# Altium schematic sheet hv_control.SchDoc: AcroIQ HV LED: MCU
size A4; DocumentNumber: 4; Revision: B; SheetNumber: 3; SheetTotal: 4
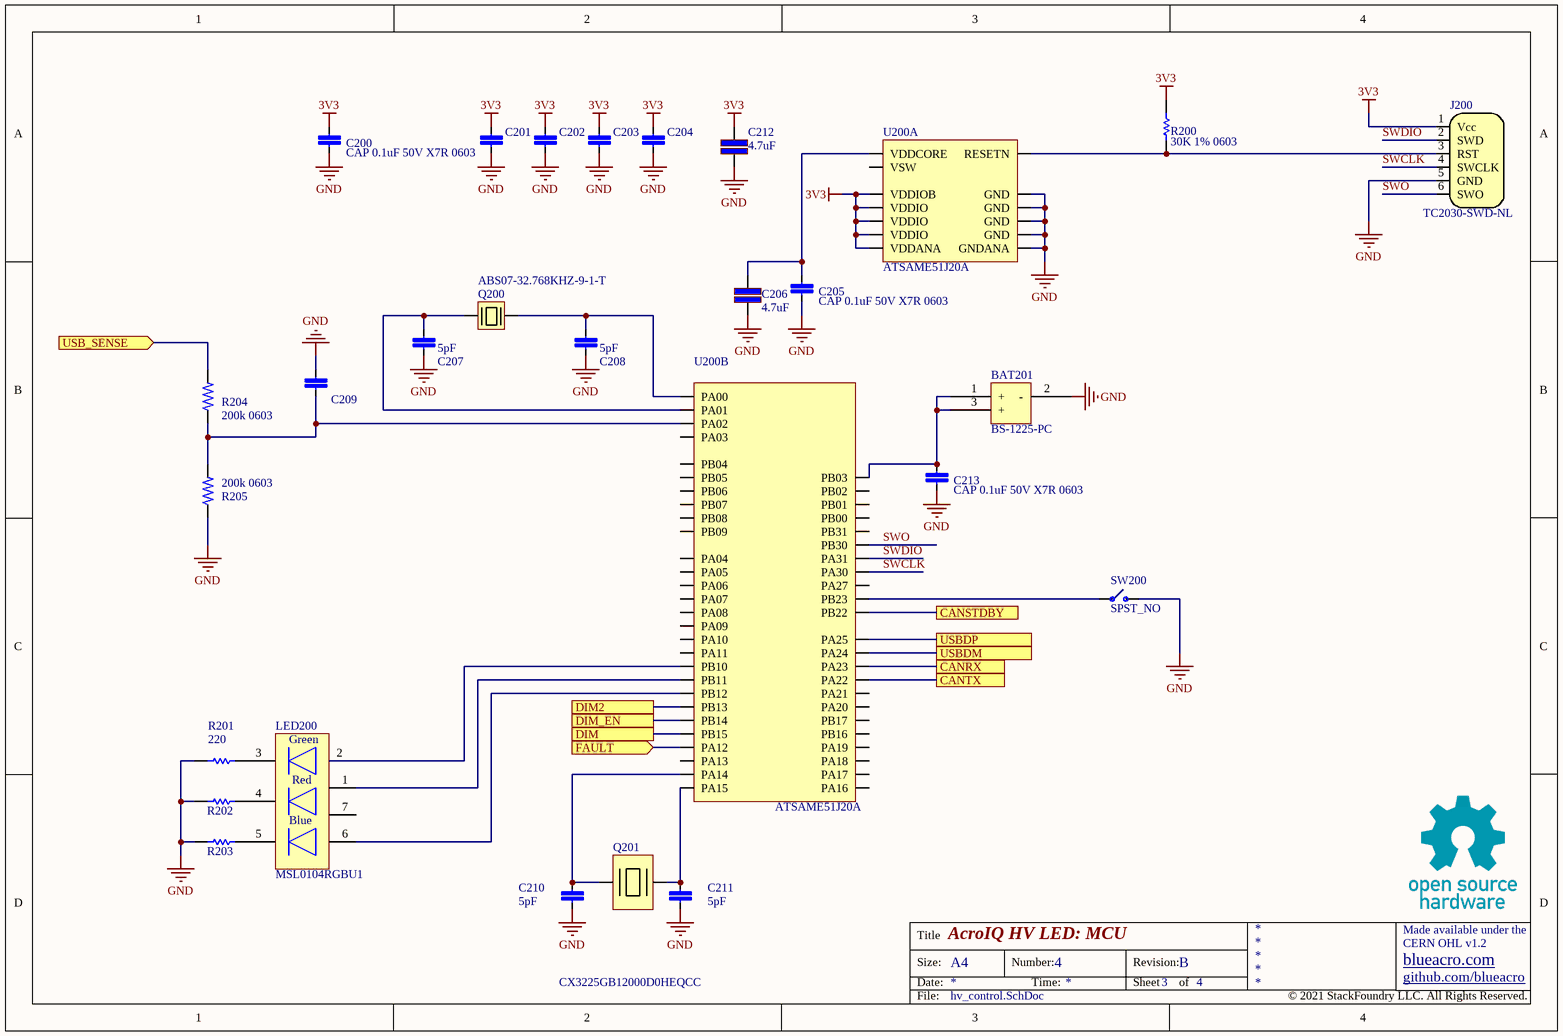
[diagram p0: hv_control.SchDoc]

## Parts
BAT201  BS-1225-PC  [BS-1225-PC-Footprint-1]
C200  CAP 0.1uF 50V X7R 0603  [FP-CL10-IPC_B]
C201  CAP 0.1uF 50V X7R 0603  [FP-CL10-IPC_B]  (value not drawn)
C202  CAP 0.1uF 50V X7R 0603  [FP-CL10-IPC_B]  (value not drawn)
C203  CAP 0.1uF 50V X7R 0603  [FP-CL10-IPC_B]  (value not drawn)
C204  CAP 0.1uF 50V X7R 0603  [FP-CL10-IPC_B]  (value not drawn)
C205  CAP 0.1uF 50V X7R 0603  [FP-CL10-IPC_B]
C206  4.7uF  [CAPC3225X20N]
C207  5pF  [FP-CL10-IPC_B]
C208  5pF  [FP-CL10-IPC_B]
C209  CAP 0.022uF 50V X7R 0603  [FP-CL10-IPC_B]  (value not drawn)
C210  5pF  [FP-CL10-IPC_B]
C211  5pF  [FP-CL10-IPC_B]
C212  4.7uF  [CAPC3225X20N]
C213  CAP 0.1uF 50V X7R 0603  [FP-CL10-IPC_B]
J200  TC2030-SWD-NL  [TC2030-MCP-NL]  (no BOM)
LED200  MSL0104RGBU1  [FP-MSL0104-MFG]
Q200  ABS07-32.768KHZ-9-1-T  [ABS07-32.768KHZ-9-1-T-Footprint-1]
Q201  CX3225GB12000D0HEQCC  [CX3225GB12000D0HEQCC-Footprint-1]
R200  30K 1% 0603  [RESC1608-IPC-NL]
R201  220  [RESC1608-IPC-NL]
R202  220R 0603 5%  [RESC1608-IPC-NL]  (value not drawn)
R203  220R 0603 5%  [RESC1608-IPC-NL]  (value not drawn)
R204  200k 0603  [RESC1608-IPC-NL]
R205  200k 0603  [RESC1608-IPC-NL]
SW200  SPST_NO  [TE_1825027-8]
U200  ATSAME51J20A  [LQFP64]  (parts A,B of 2)

## Ports
CANRX, CANSTDBY, CANTX, DIM, DIM2, DIM_EN, FAULT (in), USB_SENSE (in), USBDM, USBDP

## Nets
3V3: C200.1 C201.1 C202.1 C203.1 C204.1 C212.2 J200.1(Vcc) R200.2 U200.8(VDDANA) U200.21(VDDIOB) U200.34(VDDIO) U200.48(VDDIO) U200.56(VDDIO)
GND: BAT201.2(-) C200.2 C201.2 C202.2 C203.2 C204.2 C205.2 C206.1 C207.2 C208.2 C209.1 C210.2 C211.2 C212.1 C213.2 J200.5(GND) R201.1 R202.1 R203.1 R205.1 SW200.1 U200.7(GNDANA) U200.22(GND) U200.33(GND) U200.47(GND) U200.54(GND)
CANRX: U200.44(PA23) ; port CANRX
CANSTDBY: U200.49(PB22) ; port CANSTDBY
CANTX: U200.43(PA22) ; port CANTX
DIM: U200.28(PB15) ; port DIM
DIM2: U200.26(PB13) ; port DIM2
DIM_EN: U200.27(PB14) ; port DIM_EN
FAULT: U200.29(PA12) ; port FAULT
SWCLK: J200.4(SWCLK) U200.57(PA30)
SWDIO: J200.2(SWD) U200.58(PA31)
SWO: J200.6(SWO) U200.59(PB30)
USB_SENSE: R204.2 ; port USB_SENSE
USBDM: U200.45(PA24) ; port USBDM
USBDP: U200.46(PA25) ; port USBDP
NetBAT201_1: BAT201.1(+) BAT201.3(+) C213.1 U200.64(PB03)
NetC205_1: C205.1 C206.2 U200.53(VDDCORE)
NetC207_1: C207.1 Q200.1 U200.2(PA01)
NetC208_1: C208.1 Q200.2 U200.1(PA00)
NetC209_2: C209.2 R204.1 R205.2 U200.3(PA02)
NetC210_1: C210.1 Q201.1 U200.31(PA14)
NetC211_1: C211.1 Q201.3 U200.32(PA15)
NetJ200_3: J200.3(RST) R200.1 U200.52(RESETN)
NetLED200_1: LED200.1(R_A) U200.24(PB11)
NetLED200_2: LED200.2(G_A) U200.23(PB10)
NetLED200_3: LED200.3(G_K) R201.2
NetLED200_4: LED200.4(R_K) R202.2
NetLED200_5: LED200.5(B_K) R203.2
NetLED200_6: LED200.6(B_A) U200.25(PB12)
NetSW200_2: SW200.2 U200.50(PB23)

Not connected (* = marked no-connect by the designer): LED200 7(R_A); U200 4(PA03) 5(PB04) 6(PB05) 9(PB06) 10(PB07) 11(PB08) 12(PB09) 13(PA04) 14(PA05) 15(PA06) 16(PA07) 17(PA08) 18(PA09) 19(PA10) 20(PA11) 30(PA13) 35(PA16) 36(PA17) 37(PA18) 38(PA19) 39(PB16) 40(PB17) 41(PA20) 42(PA21) 51(PA27) 55(VSW) 60(PB31) 61(PB00) 62(PB01) 63(PB02)

## Notes on the sheet
- Title
- Size:
- Date:
- A4
- Number:
- Time:
- Revision:
- Sheet
- of
- github.com/blueacro
- blueacro.com
- CERN OHL v1.2
- Made available under the
- File:
- © 2021 StackFoundry LLC. All Rights Reserved.
- (in symbol CMP-007-00038-2) Green; Red; Blue

## Library data of the parts
BAT201 = CMP-001-0002-2: BATTERY HOLDER COIN PC PIN
C200-C205 C213 = CMP-001-00084-4: Cap Ceramic 0.1uF 50V X7R 20% SMD 0603 125C Paper T/R
C206 C212 = CMP-001-00083-2: CAP CER 4.7UF 50V X7R 1210; Tolerance: 10%; Material: Ceramic; Height: 1.8mm; Capacitance: 4.7uF; Contact Plating: Tin; Length: 3.2mm; Mount: Surface Mount; Dielectric: X7R; Case Code (Imperial): 1210; Min Operating Temperature: -55°C; Radiation Hardening: No; Lead Free: Lead Free; Max Operating Temperature: 125°C; Width: 0.098inch; Thickness: 0.079inch; Case/Package: 1210; Voltage Rating: 50V; Case Code (Metric): 3225; Voltage: 50V; Package Quantity: 1; Packaging: Tape and Reel; Depth: 2.5mm
C207 C208 C210 C211 = CMP-001-00088-3: CAP CER 5PF 50V C0G/NP0 0603; Dielectric: C0G; Capacitance: 5pF; Depth: 0.8mm; Width: 0.031inch; Case/Package: 0603; Thickness: 0.035inch; Case Code (Imperial): 0603; Packaging: Tape and Reel; Mount: Surface Mount; Max Operating Temperature: 125°C; Height: 0.8mm; Min Operating Temperature: -55°C; Voltage Rating: 50V; Package Quantity: 4000; Case Code (Metric): 1608; Radiation Hardening: No; Length: 1.6mm
C209 = CMP-001-00086-5: SAMSUNG ELECTRO-MECHANICS - CL10B223KB8NNNC - SMD Multilayer Ceramic Capacitor, 0.022 µF, 50 V, 0603 [1608 Metric], ± 10%, X7R, CL Series
J200 = CMP-147-0001-1: Conector par ICD; Source: TC2030.SchLib; Design Item ID: TC2030-SWD-NL
LED200 = CMP-007-00038-2: ROHM - MSL0104RGBU1 - LED ROT/GRÜN/BLAU 700/1200/400 MCD, 2709; Forward Voltage: 3.2V; Color: Blue,Green,Red; Dominant Wavelength: 470nm; Lens Transparency: Diffused; Test Current: 20mA; Luminous Intensity: 400mcd; Lens Color: White; Case/Package: SMD/SMT; Lead Free: Lead Free; Height: 2.15mm; Packaging: Tape and Reel; Mount: Surface Mount; Length: 6.9mm; Width: 2.2mm
Q200 = CMP-003-00031-1: CRYSTAL 32.768KHZ 9PF SMD; ESR (Equivalent Series Resistance): 70kR; Frequency Tolerance: 10ppm; Lead Free: Lead Free; Package Quantity: 3000; Packaging: Tape and Reel; Length: 0.126inch; Frequency: 32.768kHz; Load Capacitance: 9pF; Height: 0.035inch; Case/Package: SMD/SMT; Termination: SMD/SMT; Mount: Surface Mount; Tolerance: 10ppm; Max Operating Temperature: 85°C; Width: 0.061inch; Min Operating Temperature: -40°C
Q201 = CMP-003-00030-1: Crystal 12MHz ±20ppm (Tol) ±30ppm (Stability) 8pF FUND 250Ohm 4-Pin SMD T/R; ESR (Equivalent Series Resistance): 250R; Width: 2.5mm; Tolerance: 20ppm; REACH SVHC: No SVHC; Load Capacitance: 8pF; Weight: 0.000564oz; Frequency: 12MHz; Frequency Tolerance: 20ppm; Min Operating Temperature: -10°C; Termination: SMD/SMT; Packaging: Tape and Reel; Height: 0.035inch; Length: 0.126inch; Mount: Surface Mount; Frequency Stability: 30ppm; Package Quantity: 3000; Case/Package: SMD/SMT; Max Operating Temperature: 70°C
R200 = CMP-009-00178-4: YAGEO - RC0603FR-0730KL - RES, THICK FILM, 30K, 1%, 0.1W, 0603, REEL; Voltage Rating (DC): 50V; Resistance: 30kR; Power Rating: 100mW; Temperature Coefficient: 100ppm/°C; Package Quantity: 5000; Depth: 0.8mm; REACH SVHC: Unknown; Case/Package: 0603; Case Code (Metric): 1608; Resistor Type: Thick Film; Termination: SMD/SMT; Number of Pins: 2; Packaging: Tape and Reel; Military Standard: Not; Voltage Rating: 50V; Length: 1.6mm; Height: 0.45mm; Tolerance: 1%; Lead Free: Lead Free; Width: 0.8mm; Case Code (Imperial): 0603; Max Operating Temperature: 155°C; Min Operating Temperature: -55°C
R201 = CMP-009-00183-2: YAGEO - RC0603JR-07220RL - SMD Chip Resistor, 0603 [1608 Metric], 220 ohm, RC Series, 75 V, Thick Film, 100 mW; Tolerance: 5%; Voltage Rating: 50V; Temperature Coefficient: 100ppm/°C; Resistance: 220R; Power Rating: 100mW; Working Voltage: 75V; Military Standard: Not; Max Operating Temperature: 155°C; Resistor Type: Thick Film; Number of Terminations: 2; Length: 1.6mm; Case Code (Metric): 1608; Packaging: Tape and Reel; Min Operating Temperature: -55°C; Depth: 0.8mm; Width: 0.8mm; Number of Pins: 2; Case/Package: 0603; Termination: SMD/SMT; REACH SVHC: No SVHC; Voltage Rating (DC): 50V; Case Code (Imperial): 0603; Lead Free: Lead Free
R202 R203 = CMP-009-00183-2: YAGEO - RC0603JR-07220RL - SMD Chip Resistor, 0603 [1608 Metric], 220 ohm, RC Series, 75 V, Thick Film, 100 mW; Voltage Rating: 50V; Temperature Coefficient: 100ppm/°C; Power Rating: 100mW; Working Voltage: 75V; Military Standard: Not; Tolerance: 5%; Max Operating Temperature: 155°C; Resistor Type: Thick Film; Resistance: 220R; Number of Terminations: 2; Length: 1.6mm; Case Code (Metric): 1608; Packaging: Tape and Reel; Min Operating Temperature: -55°C; Depth: 0.8mm; Width: 0.8mm; Number of Pins: 2; Case/Package: 0603; Termination: SMD/SMT; REACH SVHC: No SVHC; Voltage Rating (DC): 50V; Case Code (Imperial): 0603; Lead Free: Lead Free
R204 R205 = CMP-009-00195-1: Thick Film Resistors - SMD 200K OHM 5%
SW200 = CMP-058-0000-2: Source: switches.SchLib; Design Item ID: SPST_NO
U200 = CMP-020-00023-1: IC MCU 32BIT 1MB FLASH 64TQFP; Oscillator Type: Internal; Frequency: 120MHz; Peripherals: Brown-out Detect/Reset,POR,PWM,DMA; Core Architecture: ARM; Interface: I2C,SPI,USB,IrDA,MMC,SD,UART,USART,EBI/EMI; Number of I/Os: 51; Memory Size: 1MB; Memory Type: FLASH; Case/Package: TQFP; Max Operating Temperature: 85°C; Number of Pins: 64; Min Operating Temperature: -40°C; Packaging: Cut Tape